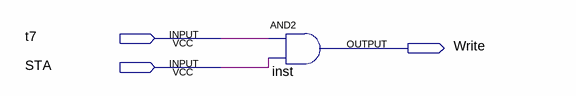
[diagram p0: schematic sheet]
// Quartus schematic Write.bdf as structural Verilog: 1 symbols, 3 pins
module Write (
  input  t7,
  input  STA,
  output Write
);

  and inst (Write, t7, STA);
endmodule
